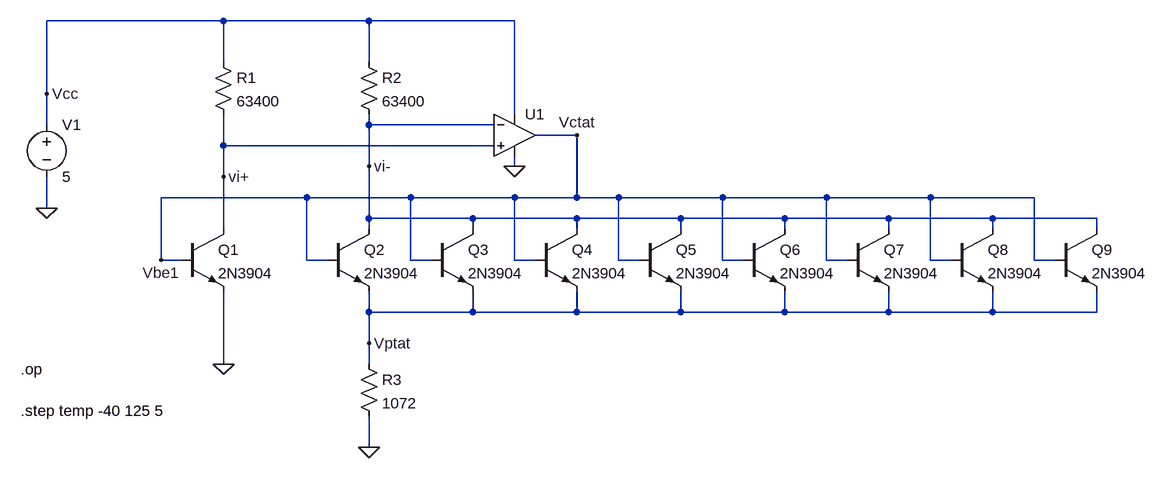
[diagram p0: schematic PTAT_voltage_generator.asc]
PTAT_voltage_generator.asc, the LTspice schematic file:
Version 4
SHEET 1 952 680
WIRE -1600 -1088 -1872 -1088
WIRE -1376 -1088 -1600 -1088
WIRE -1152 -1088 -1376 -1088
WIRE -1600 -1024 -1600 -1088
WIRE -1376 -1024 -1376 -1088
WIRE -1872 -976 -1872 -1088
WIRE -1152 -944 -1152 -1088
WIRE -1872 -928 -1872 -976
WIRE -1376 -928 -1376 -944
WIRE -1184 -928 -1376 -928
WIRE -1056 -912 -1120 -912
WIRE -1600 -896 -1600 -944
WIRE -1184 -896 -1600 -896
WIRE -1376 -864 -1376 -928
WIRE -1152 -864 -1152 -880
WIRE -1600 -848 -1600 -896
WIRE -1472 -816 -1696 -816
WIRE -1312 -816 -1472 -816
WIRE -1152 -816 -1312 -816
WIRE -1056 -816 -1056 -912
WIRE -1056 -816 -1152 -816
WIRE -992 -816 -1056 -816
WIRE -832 -816 -992 -816
WIRE -672 -816 -832 -816
WIRE -512 -816 -672 -816
WIRE -352 -816 -512 -816
WIRE -1872 -800 -1872 -848
WIRE -1376 -784 -1376 -864
WIRE -1216 -784 -1376 -784
WIRE -1056 -784 -1216 -784
WIRE -896 -784 -1056 -784
WIRE -736 -784 -896 -784
WIRE -576 -784 -736 -784
WIRE -416 -784 -576 -784
WIRE -256 -784 -416 -784
WIRE -1600 -768 -1600 -848
WIRE -1376 -768 -1376 -784
WIRE -1216 -768 -1216 -784
WIRE -1056 -768 -1056 -784
WIRE -896 -768 -896 -784
WIRE -736 -768 -736 -784
WIRE -576 -768 -576 -784
WIRE -416 -768 -416 -784
WIRE -256 -768 -256 -784
WIRE -1696 -720 -1696 -816
WIRE -1664 -720 -1696 -720
WIRE -1472 -720 -1472 -816
WIRE -1440 -720 -1472 -720
WIRE -1312 -720 -1312 -816
WIRE -1280 -720 -1312 -720
WIRE -1152 -720 -1152 -816
WIRE -1120 -720 -1152 -720
WIRE -992 -720 -992 -816
WIRE -960 -720 -992 -720
WIRE -832 -720 -832 -816
WIRE -800 -720 -832 -720
WIRE -672 -720 -672 -816
WIRE -640 -720 -672 -720
WIRE -512 -720 -512 -816
WIRE -480 -720 -512 -720
WIRE -352 -720 -352 -816
WIRE -320 -720 -352 -720
WIRE -1376 -640 -1376 -672
WIRE -1216 -640 -1216 -672
WIRE -1216 -640 -1376 -640
WIRE -1056 -640 -1056 -672
WIRE -1056 -640 -1216 -640
WIRE -896 -640 -896 -672
WIRE -896 -640 -1056 -640
WIRE -736 -640 -736 -672
WIRE -736 -640 -896 -640
WIRE -576 -640 -576 -672
WIRE -576 -640 -736 -640
WIRE -416 -640 -416 -672
WIRE -416 -640 -576 -640
WIRE -256 -640 -256 -672
WIRE -256 -640 -416 -640
WIRE -1376 -592 -1376 -640
WIRE -1600 -560 -1600 -672
WIRE -1376 -560 -1376 -592
WIRE -1376 -432 -1376 -480
FLAG -1600 -560 0
FLAG -1872 -800 0
FLAG -1376 -432 0
FLAG -1152 -864 0
FLAG -1056 -912 Vctat
FLAG -1872 -976 Vcc
FLAG -1376 -592 Vptat
FLAG -1376 -864 vi-
FLAG -1600 -848 vi+
FLAG -1696 -720 Vbe1
SYMBOL npn -1664 -768 R0
SYMATTR InstName Q1
SYMATTR Value 2N3904
SYMBOL voltage -1872 -944 R0
WINDOW 123 0 0 Left 0
WINDOW 39 0 0 Left 0
SYMATTR InstName V1
SYMATTR Value 5
SYMBOL res -1616 -1040 R0
SYMATTR InstName R1
SYMATTR Value 63400
SYMBOL npn -1440 -768 R0
SYMATTR InstName Q2
SYMATTR Value 2N3904
SYMBOL res -1392 -1040 R0
SYMATTR InstName R2
SYMATTR Value 63400
SYMBOL npn -1280 -768 R0
SYMATTR InstName Q3
SYMATTR Value 2N3904
SYMBOL npn -1120 -768 R0
SYMATTR InstName Q4
SYMATTR Value 2N3904
SYMBOL npn -960 -768 R0
SYMATTR InstName Q5
SYMATTR Value 2N3904
SYMBOL npn -800 -768 R0
SYMATTR InstName Q6
SYMATTR Value 2N3904
SYMBOL npn -640 -768 R0
SYMATTR InstName Q7
SYMATTR Value 2N3904
SYMBOL npn -480 -768 R0
SYMATTR InstName Q8
SYMATTR Value 2N3904
SYMBOL npn -320 -768 R0
SYMATTR InstName Q9
SYMATTR Value 2N3904
SYMBOL res -1392 -576 R0
SYMATTR InstName R3
SYMATTR Value 1072
SYMBOL Opamps\\UniversalOpamp2 -1152 -912 R0
SYMATTR InstName U1
TEXT -1912 -552 Left 2 !.op
TEXT -1912 -488 Left 2 !.step temp -40 125 5

The netlist it stands for:
* PTAT_voltage_generator.asc
Q1 vi+ Vbe1 0 0 2N3904
V1 Vcc 0 5
R1 Vcc vi+ 63400
Q2 vi- Vbe1 Vptat 0 2N3904
R2 Vcc vi- 63400
Q3 vi- Vbe1 Vptat 0 2N3904
Q4 vi- Vbe1 Vptat 0 2N3904
Q5 vi- Vbe1 Vptat 0 2N3904
Q6 vi- Vbe1 Vptat 0 2N3904
Q7 vi- Vbe1 Vptat 0 2N3904
Q8 vi- Vbe1 Vptat 0 2N3904
Q9 vi- Vbe1 Vptat 0 2N3904
R3 Vptat 0 1072
XU1 vi+ vi- Vcc 0 Vbe1 level.2 Avol=1Meg GBW=10Meg Slew=10Meg ilimit=25m rail=0 Vos=0 phimargin=45 en=0 enk=0 in=0 ink=0 Rin=500Meg  ; pins IN+ IN- V+ V- OUT
.model NPN NPN
.model PNP PNP
.lib standard.bjt
.op
.step temp -40 125 5
.lib UniversalOpamps2.sub
.backanno
.end